# EAGLE design Hank (EAGLE 9.5.2)
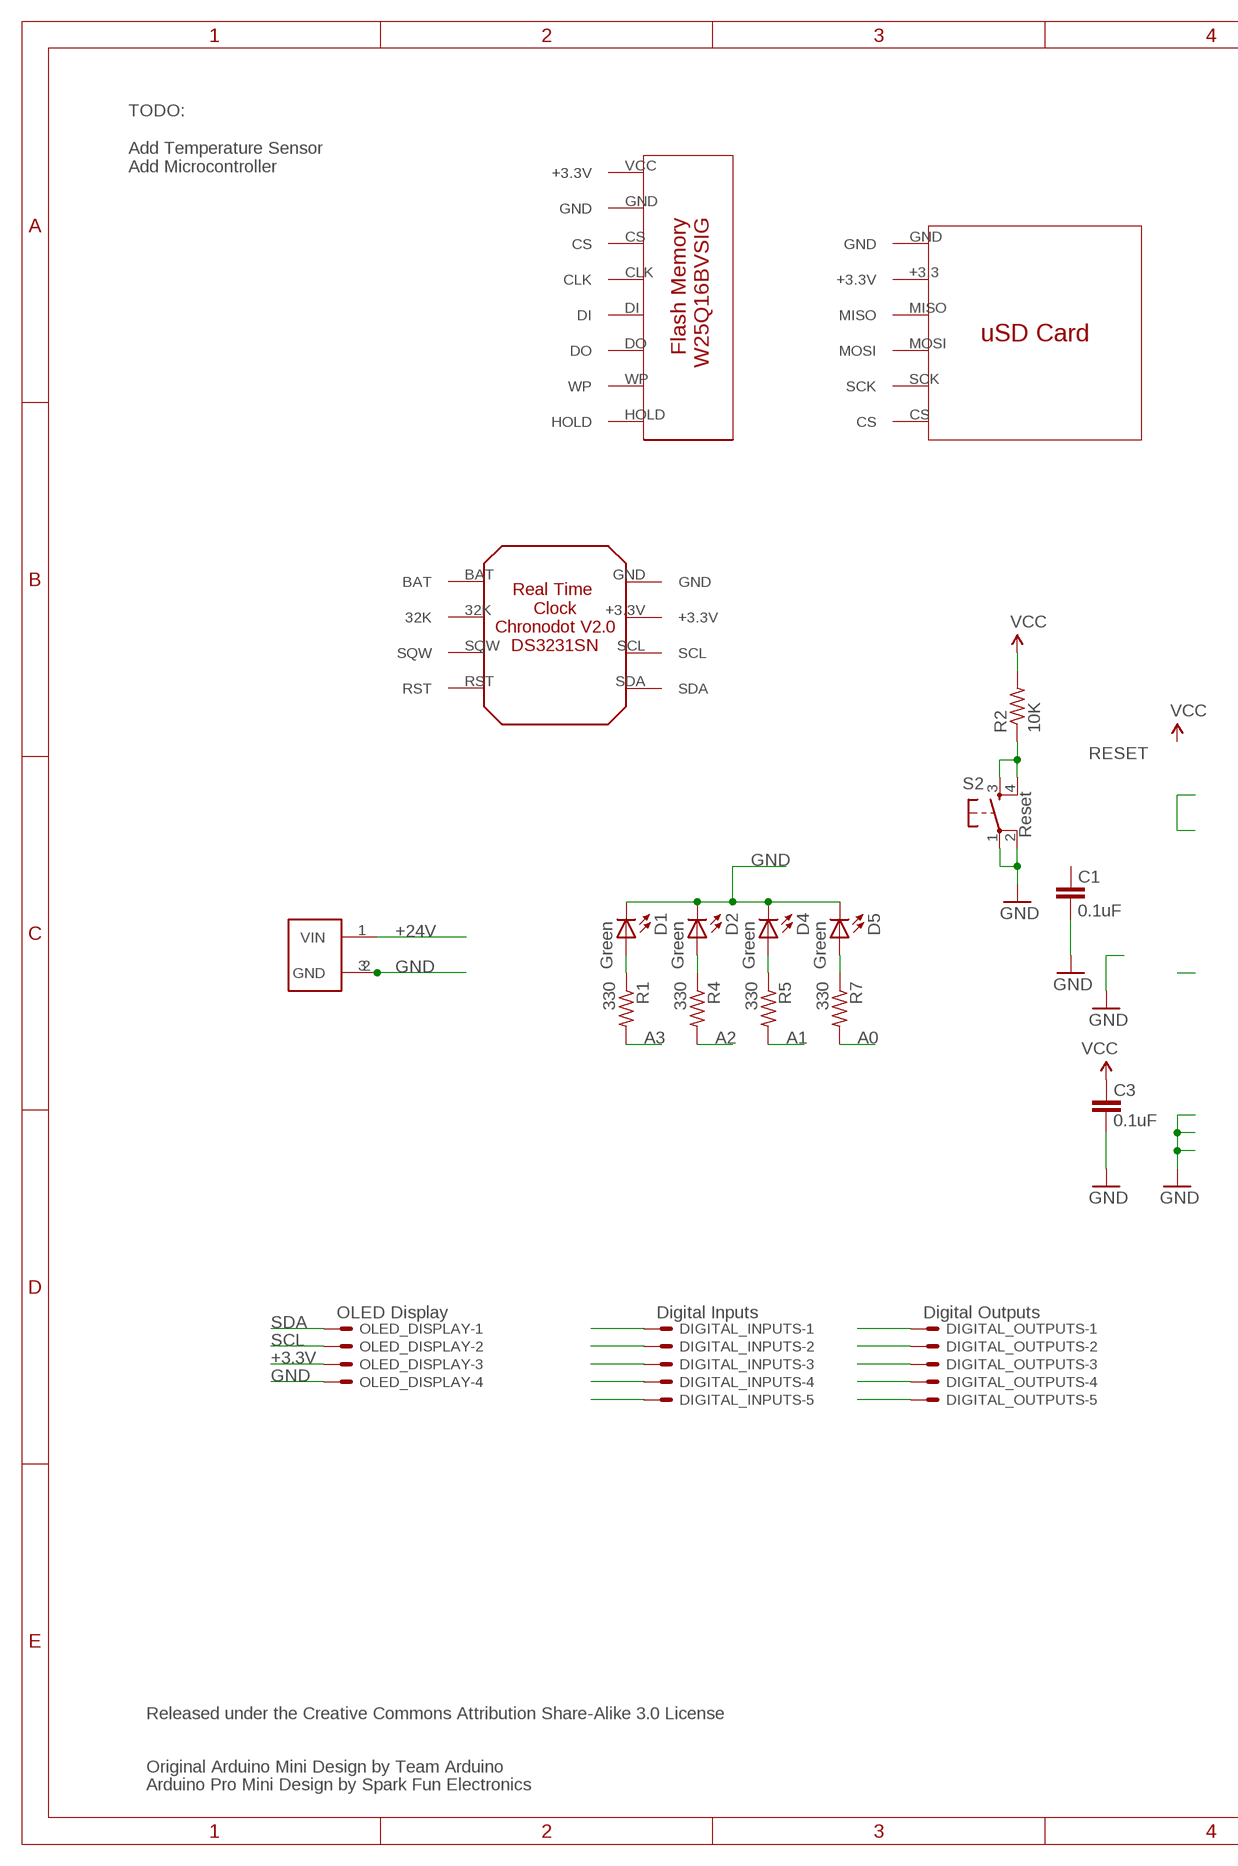
[diagram p0: schematic, sheet 1, part 1 of 2]
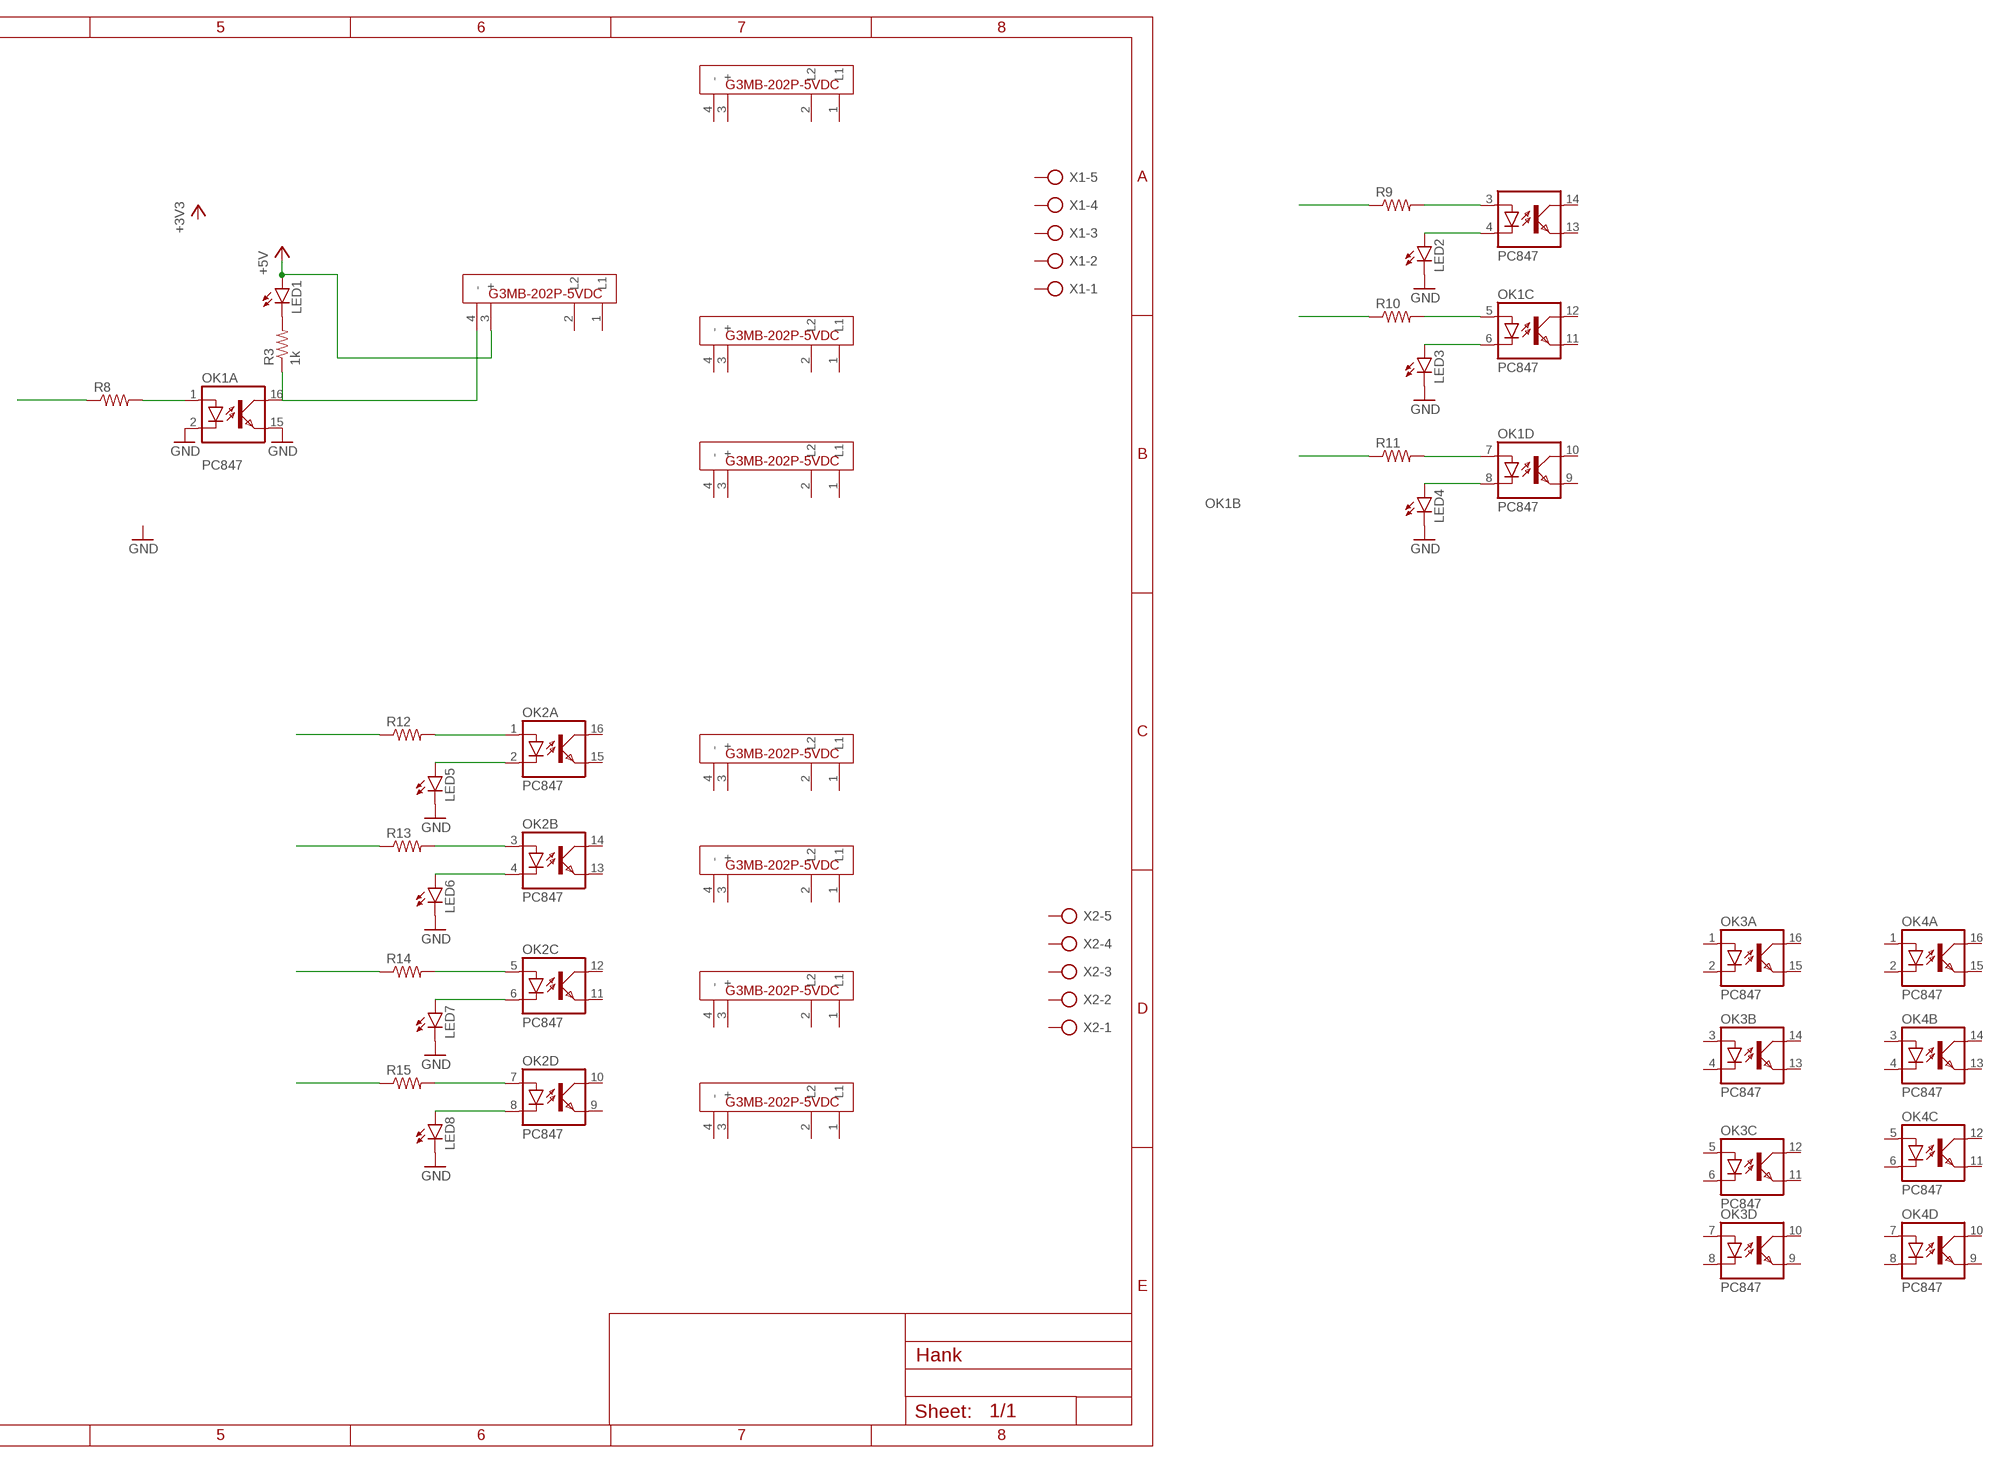
[diagram p1: schematic, sheet 1, part 2 of 2]

## Parts
C1  0.1uF  C-EUC0603  [C0603]
C3  0.1uF  C-EUC0603  [C0603]
D1  Green  LED0603  [LED-0603]
D2  Green  LED0603  [LED-0603]
D4  Green  LED0603  [LED-0603]
D5  Green  LED0603  [LED-0603]
DIGITAL_INPUTS  Digital Inputs  22-23-2051  [22-23-2051]
DIGITAL_OUTPUTS  Digital Outputs  22-23-2051  [22-23-2051]
LED1  LED3MM  [LED3MM]
LED2  LED3MM  [LED3MM]
LED3  LED3MM  [LED3MM]
LED4  LED3MM  [LED3MM]
LED5  LED3MM  [LED3MM]
LED6  LED3MM  [LED3MM]
LED7  LED3MM  [LED3MM]
LED8  LED3MM  [LED3MM]
OK1  PC847  [DIL16]
OK2  PC847  [DIL16]
OK3  PC847  [DIL16]
OK4  PC847  [DIL16]
OLED_DISPLAY  OLED Display  22-23-2041  [22-23-2041]
R1  330  R-US_R0603  [R0603]
R2  10K  R-US_R0603  [R0603]
R3  1k  R-US_0207/10  [0207/10]
R4  330  R-US_R0603  [R0603]
R5  330  R-US_R0603  [R0603]
R7  330  R-US_R0603  [R0603]
R8  R-US_0207/10  [0207/10]
R9  R-US_0207/10  [0207/10]
R10  R-US_0207/10  [0207/10]
R11  R-US_0207/10  [0207/10]
R12  R-US_0207/10  [0207/10]
R13  R-US_0207/10  [0207/10]
R14  R-US_0207/10  [0207/10]
R15  R-US_0207/10  [0207/10]
S2  Reset  TAC_SWITCHSMD  [TACTILE_SWITCH_SMD]
U$1  SSR  [SSR_FOOTPRINT]
U$3  BARREL-3.5MM  [BARREL-3.5MM]
U$4  FLASH_MEMORY  [FLASHMEMORY_FOOTPRINT]
U$6  RTC  [RTC_FOOTPRINT]
U$7  SSR  [SSR_FOOTPRINT]
U$8  SSR  [SSR_FOOTPRINT]
U$9  SSR  [SSR_FOOTPRINT]
U$10  SSR  [SSR_FOOTPRINT]
U$11  SSR  [SSR_FOOTPRINT]
U$12  SSR  [SSR_FOOTPRINT]
U$13  SSR  [SSR_FOOTPRINT]
U$14  SD_CARD_READER  [SD_CARD_READER_FOOTPRINT]
X1  AK300/5  [AK300/5]
X2  AK300/5  [AK300/5]

## Nets
+3.3V: OLED_DISPLAY.3
+5V: LED1.A U$7.3(+)
+24V: U$3.1(VIN)
A0: R7.2
A1: R5.2
A2: R4.2
A3: R1.2
GND [vcc]: C1.1 C3.1 D1.C D2.C D4.C D5.C LED2.K(C) LED3.K(C) LED4.K(C) LED5.K(C) LED6.K(C) LED7.K(C) LED8.K(C) OK1.2(A:C) OK1.15(A:EMIT) OLED_DISPLAY.4 S2.1 S2.2 U$3.2(GND__) U$3.3(GND)
N$2: DIGITAL_INPUTS.1
N$3: D1.A R1.1
N$4: D2.A R4.1
N$5: D4.A R5.1
N$6: DIGITAL_INPUTS.2
N$7: DIGITAL_INPUTS.3
N$8: D5.A R7.1
N$9: DIGITAL_INPUTS.4
N$10: DIGITAL_INPUTS.5
N$11: DIGITAL_OUTPUTS.1
N$12: DIGITAL_OUTPUTS.2
N$13: DIGITAL_OUTPUTS.3
N$14: DIGITAL_OUTPUTS.4
N$15: DIGITAL_OUTPUTS.5
N$16: LED4.A OK1.8(D:C)
N$17: OK1.7(D:A) R11.2
N$18: OK1.1(A:A) R8.2
N$19: LED1.K(C) R3.2
N$20: OK1.3(B:A) R9.2
N$21: LED2.A OK1.4(B:C)
N$22: OK1.5(C:A) R10.2
N$23: LED3.A OK1.6(C:C)
N$24: OK2.1(A:A) R12.2
N$25: OK2.3(B:A) R13.2
N$26: OK2.5(C:A) R14.2
N$27: OK2.7(D:A) R15.2
N$28: LED6.A OK2.4(B:C)
N$29: LED5.A OK2.2(A:C)
N$30: LED7.A OK2.6(C:C)
N$31: LED8.A OK2.8(D:C)
N$32: R8.1
N$33: R9.1
N$34: R10.1
N$35: R11.1
N$36: R12.1
N$37: R13.1
N$38: R14.1
N$39: R15.1
N$42: OK1.16(A:COL) R3.1 U$7.4(-)
RESET: R2.1 S2.3 S2.4
SCL: OLED_DISPLAY.2
SDA: OLED_DISPLAY.1
VCC: C3.2 R2.2
Unconnected: C1.2 OK1.9(D:EMIT) OK1.10(D:COL) OK1.11(C:EMIT) OK1.12(C:COL) OK1.13(B:EMIT) OK1.14(B:COL) OK2.9(D:EMIT) OK2.10(D:COL) OK2.11(C:EMIT) OK2.12(C:COL) OK2.13(B:EMIT) OK2.14(B:COL) OK2.15(A:EMIT) OK2.16(A:COL) OK3.1(A:A) OK3.2(A:C) OK3.3(B:A) OK3.4(B:C) OK3.5(C:A) OK3.6(C:C) OK3.7(D:A) OK3.8(D:C) OK3.9(D:EMIT) OK3.10(D:COL) OK3.11(C:EMIT) OK3.12(C:COL) OK3.13(B:EMIT) OK3.14(B:COL) OK3.15(A:EMIT) OK3.16(A:COL) OK4.1(A:A) OK4.2(A:C) OK4.3(B:A) OK4.4(B:C) OK4.5(C:A) OK4.6(C:C) OK4.7(D:A) OK4.8(D:C) OK4.9(D:EMIT) OK4.10(D:COL) OK4.11(C:EMIT) OK4.12(C:COL) OK4.13(B:EMIT) OK4.14(B:COL) OK4.15(A:EMIT) OK4.16(A:COL) U$1.1(L1) U$1.2(L2) U$1.3(+) U$1.4(-) U$4.CLK U$4.CS U$4.DI U$4.DO U$4.GND U$4.HOLD U$4.VCC(+3.3V) U$4.WP U$6.32K U$6.+3.3V U$6.BAT U$6.GND U$6.RST U$6.SCL U$6.SDA U$6.SQW U$7.1(L1) U$7.2(L2) U$8.1(L1) U$8.2(L2) U$8.3(+) U$8.4(-) U$9.1(L1) U$9.2(L2) U$9.3(+) U$9.4(-) U$10.1(L1) U$10.2(L2) U$10.3(+) U$10.4(-) U$11.1(L1) U$11.2(L2) U$11.3(+) U$11.4(-) U$12.1(L1) U$12.2(L2) U$12.3(+) U$12.4(-) U$13.1(L1) U$13.2(L2) U$13.3(+) U$13.4(-) U$14.+3.3(+3.3V) U$14.CS U$14.GND U$14.MISO U$14.MOSI U$14.SCK X1.1 X1.2 X1.3 X1.4 X1.5 X2.1 X2.2 X2.3 X2.4 X2.5

## Notes on the sheet
- TODO:
  
  Add Temperature Sensor
  Add Microcontroller
- Released under the Creative Commons Attribution Share-Alike 3.0 License
- Original Arduino Mini Design by Team Arduino
- Arduino Pro Mini Design by Spark Fun Electronics

## Library data of the parts
C1 C3 = resistor:C-EU: CAPACITOR, European symbol
D1 D2 D4 D5 = SparkFun:LED: LEDs Standard schematic elements and footprints for 5mm, 3mm, 1206, and 0603 sized LEDs. 5mm - Spark Fun Electronics SKU : COM-00529 (and others)
DIGITAL_INPUTS DIGITAL_OUTPUTS = con-molex:22-23-2051: .100" (2.54mm) Center Header - 5 Pin; MF: MOLEX; MPN: 22-23-2051; OC_FARNELL: 1462952; OC_NEWARK: 38C9178
LED1-LED8 = led:LED: LED OSRAM: - CHIPLED LG R971, LG N971, LY N971, LG Q971, LY Q971, LO R971, LY R971 LH N974, LH R974 LS Q976, LO Q976, LY Q976 LO Q996 - Hyper CHIPLED LW Q18S LB Q993, LB Q99A, LB R99A - SideLED LS A670, LO A670, LY A670, LG A670, LP A670 LB A673, LV A673, LT A673, LW A673 LH A674 LY A675 LS A676, LA A676, LO A676, LY A676, LW A676 LS A679, LY A679, LG A679 - Hyper Micro SIDELED® LS Y876, LA Y876, LO Y876, LY Y876 LT Y87S - SmartLED LW L88C, LW L88S LB L89C, LB L89S, LG L890 LS L89K, LO L89K, LY L89K LS L896, LA L896, LO L896, LY L896 - TOPLED LS T670, LO T670, LY T670, LG T670, LP T670 LSG T670, LSP T670, LSY T670, LOP T670, LYG T670 LG T671, LOG T671, LSG T671 LB T673, LV T673, LT T673, LW T673 LH T674 LS T676, LA T676, LO T676, LY T676, LB T676, LH T676, LSB T676, LW T676 LB T67C, LV T67C, LT T67C, LS T67K, LO T67K, LY T67K, LW E67C LS E67B, LA E67B, LO E67B, LY E67B, LB E67C, LV E67C, LT E67C LW T67C LS T679, LY T679, LG T679 LS T770, LO T770, LY T770, LG T770, LP T770 LB T773, LV T773, LT T773, LW T773 LH T774 LS E675, LA E675, LY E675, LS T675 LS T776, LA T776, LO T776, LY T776, LB T776 LHGB T686 LT T68C, LB T68C - Hyper Mini TOPLED® LB M676 - Mini TOPLED Santana® LG M470 LS M47K, LO M47K, LY M47K Source: http://www.osram.convergy.de LUXEON: - LUMILED® LXK2-PW12-R00, LXK2-PW12-S00, LXK2-PW14-U00, LXK2-PW14-V00 LXK2-PM12-R00, LXK2-PM12-S00, LXK2-PM14-U00 LXK2-PE12-Q00, LXK2-PE12-R00, LXK2-PE12-S00, LXK2-PE14-T00, LXK2-PE14-U00 LXK2-PB12-K00, LXK2-PB12-L00, LXK2-PB12-M00, LXK2-PB14-N00, LXK2-PB14-P00, LXK2-PB14-Q00 LXK2-PR12-L00, LXK2-PR12-M00, LXK2-PR14-Q00, LXK2-PR14-R00 LXK2-PD12-Q00, LXK2-PD12-R00, LXK2-PD12-S00 LXK2-PH12-R00, LXK2-PH12-S00 LXK2-PL12-P00, LXK2-PL12-Q00, LXK2-PL12-R00 Source: www.luxeon.com KINGBRIGHT: KA-3528ASYC Source: www.kingbright.com
OK1-OK4 = optocoupler:PC847: SHARP OPTO COUPLER; OC_FARNELL: 9707735; OC_NEWARK: unknown
OLED_DISPLAY = con-molex:22-23-2041: .100" (2.54mm) Center Header - 4 Pin; MF: MOLEX; MPN: 22-23-2041; OC_FARNELL: 1462920; OC_NEWARK: 38C0355
R1 R2 R4 R5 R7 = resistor:R-US_: RESISTOR, American symbol
R3 R8-R15 = rcl:R-US_: RESISTOR, American symbol; SPICEPREFIX: R
S2 = SparkFun:TAC_SWITCH: Momentary Switch Button commonly used for reset or general input. Spark Fun Electronics SKU : COM-00097
U$1 U$7-U$13 = HankLibraries:SSR
U$3 = #ROBO-Tutorial:BARREL-3.5MM
U$4 = HankLibraries:FLASH_MEMORY
U$6 = HankLibraries:RTC: Real Time Clock PCB Using DS3231SN. Developed by JVivas
U$14 = HankLibraries:SD_CARD_READER
X1 X2 = con-ptr500:AK300/5: CONNECTOR; OC_FARNELL: unknown; OC_NEWARK: unknown

## Net classes
1 vcc: width 0.254 mm

## Board
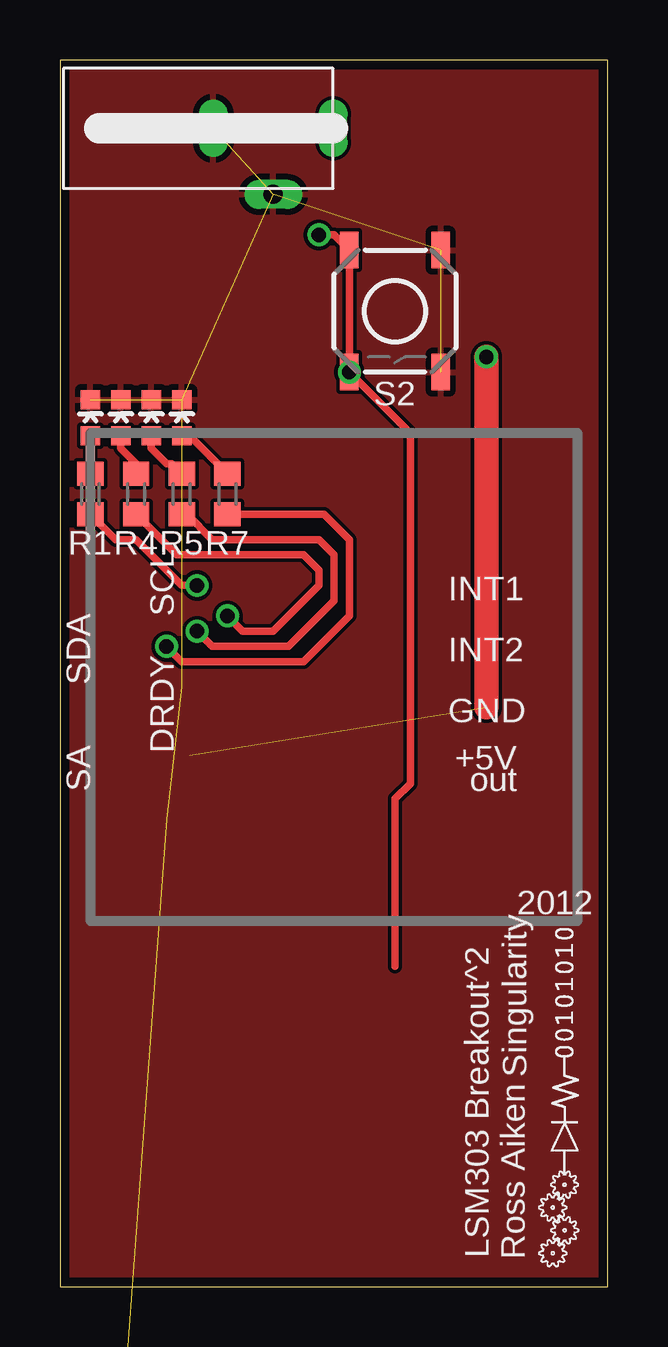
[diagram p2: board, top side]
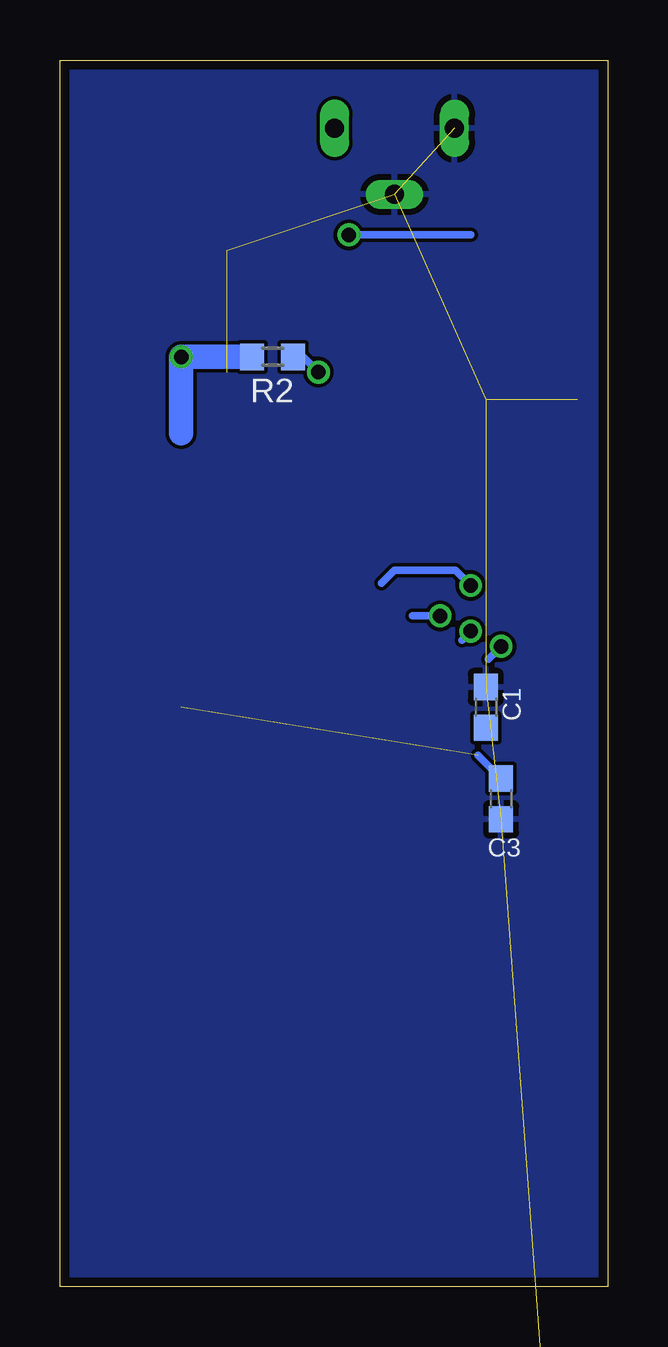
[diagram p3: board, bottom side, seen from below]

Size 22.84 x 51.1 mm. Coordinates in mm from the lower left corner, seen from the top.
Outline: 0,0 22.84,0 22.84,51.1 0,51.1 0,0
Copper layers (1*16): Top 0.0356mm / dielectric 1.5011mm / Bottom 0.0356mm
Design rules "default": minimum track width 6mil, minimum drill 13mil, track to track 6mil, track to pad 6mil, pad to pad 6mil, via to via 6mil, smd to smd 0mil, copper to edge 15mil, drill to drill 6mil, minimum pad ring 7mil, minimum via ring 7mil, stop-mask expansion 4mil, vias tented up to drill 0mil, thermal gap 10mil

### Footprints (pad centres in the part's own frame; a part is rotated, then mirrored left to right if it is on the bottom)
C0603 = smd 1.1 x 1: 1 -0.85,0; 2 0.85,0
LED-0603 = smd 0.8 x 0.8: A 0,-0.75; C 0,0.75
22-23-2051 = drill 1 long: 1 -5.08,0; 2 -2.54,0; 3 0,0; 4 2.54,0; 5 5.08,0
LED3MM = drill 0.813 octagon: A -1.27,0; K 1.27,0
DIL16 = drill 0.813 offset: 1 -8.89,-3.81; 2 -6.35,-3.81; 3 -3.81,-3.81; 4 -1.27,-3.81; 5 1.27,-3.81; 6 3.81,-3.81; 7 6.35,-3.81; 8 8.89,-3.81; 9 8.89,3.81; 10 6.35,3.81; 11 3.81,3.81; 12 1.27,3.81; 13 -1.27,3.81; 14 -3.81,3.81; 15 -6.35,3.81; 16 -8.89,3.81
22-23-2041 = drill 1 long: 1 -3.81,0; 2 -1.27,0; 3 1.27,0; 4 3.81,0
R0603 = smd 1 x 1.1: 1 -0.85,0; 2 0.85,0
0207/10 = drill 0.813 octagon: 1 -5.08,0; 2 5.08,0
TACTILE_SWITCH_SMD = smd 1.524 x 0.762: 1 -2.54,1.905; 2 2.54,1.905; 3 -2.54,-1.905; 4 2.54,-1.905
SSR_FOOTPRINT = drill 0.6 long: 1 5.08,0; 2 1.27,0; 3 -3.81,0; 4 -5.08,0
BARREL-3.5MM = drill 0.8 long: 1 2.5,0; 2 -2.5,0; 3 0,-2.75
FLASHMEMORY_FOOTPRINT = drill 0.6 long: CLK -8.89,1.27; CS -8.89,3.81; DI -8.89,-1.27; DO -8.89,-3.81; GND -8.89,6.35; HOLD -8.89,-8.89; VCC -8.89,8.89; WP -8.89,-6.35
RTC_FOOTPRINT = drill 0.6 long: 32K -6.35,2.54; +3.3V 6.35,2.54; BAT -6.35,5.08; GND 6.35,5.08; RST -6.35,-2.54; SCL 6.35,0; SDA 6.35,-2.54; SQW -6.35,0
SD_CARD_READER_FOOTPRINT = drill 0.6 long: +3.3 0,-1.27; CS 0,-6.35; GND 0,0; MISO 0,-2.54; MOSI 0,-3.81; SCK 0,-5.08
AK300/5 = drill 1.321 long: 1 -10.008,0; 2 -5.004,0; 3 0,0; 4 5.004,0; 5 10.008,0

### Placement (x,y rotation side)
C1  5.08,24.13 270 bottom
C3  4.45,20.32 90 bottom
D1  1.27,36.2 0 top
D2  2.54,36.2 0 top
D4  3.81,36.2 0 top
D5  5.08,36.2 0 top
DIGITAL_INPUTS  -8.44,-358.77 0 top  (outside the outline)
DIGITAL_OUTPUTS  -8.44,-369.64 0 top  (outside the outline)
LED1  -13.14,-289.53 0 top  (outside the outline)
LED2  -13.14,-293.91 0 top  (outside the outline)
LED3  -13.14,-298.28 0 top  (outside the outline)
LED4  -13.14,-302.65 0 top  (outside the outline)
LED5  -13.14,-307.02 0 top  (outside the outline)
LED6  -13.14,-311.4 0 top  (outside the outline)
LED7  -13.14,-315.77 0 top  (outside the outline)
LED8  -13.14,-320.14 0 top  (outside the outline)
OK1  -0.41,-134.99 0 top  (outside the outline)
OK2  -0.41,-146.89 0 top  (outside the outline)
OK3  -0.41,-158.78 0 top  (outside the outline)
OK4  -0.41,-170.67 0 top  (outside the outline)
OLED_DISPLAY  -1.72,-12.37 0 top  (outside the outline)
R1  1.27,33.02 270 top
R2  13.97,38.73 180 bottom
R3  -9.51,-378.59 0 top  (outside the outline)
R4  3.17,33.02 270 top
R5  5.08,33.02 270 top
R7  6.99,33.02 270 top
R8  -9.51,-254.07 0 top  (outside the outline)
R9  -9.51,-258.64 0 top  (outside the outline)
R10  -9.51,-263.22 0 top  (outside the outline)
R11  -9.51,-267.8 0 top  (outside the outline)
R12  -9.51,-272.37 0 top  (outside the outline)
R13  -9.51,-276.95 0 top  (outside the outline)
R14  -9.51,-281.52 0 top  (outside the outline)
R15  -9.51,-286.1 0 top  (outside the outline)
S2  13.97,40.64 270 top
U$1  -7.6,-198.75 0 top  (outside the outline)
U$3  8.89,48.26 0 top
U$4  8.89,-79.3 0 top  (outside the outline)
U$6  -6.35,-189.72 0 top  (outside the outline)
U$7  -5.08,-125.16 0 top  (outside the outline)
U$8  -7.6,-205.26 0 top  (outside the outline)
U$9  -7.6,-211.76 0 top  (outside the outline)
U$10  -7.6,-218.26 0 top  (outside the outline)
U$11  -7.6,-224.77 0 top  (outside the outline)
U$12  -7.6,-231.27 0 top  (outside the outline)
U$13  -7.6,-237.78 0 top  (outside the outline)
U$14  -12.69,-243.01 0 top  (outside the outline)
X1  -2.13,-331.6 0 top  (outside the outline)
X2  -2.13,-347.19 0 top  (outside the outline)

### Tracks (layer width: path | path; a pad name or v marks a point on that pad's centre or on a via)
+5V  (1 unrouted)
A0  (via drill 0.6)
  Top 0.305: R7.2 11.01,32.17 12.06,31.11 12.06,27.94 10.16,26.04 5.08,26.04 v4.45,26.67
  Bottom 0.305: v4.45,26.67 4.99,26.13
A1  (via drill 0.6)
  Top 0.305: R5.2 5.29,32.17 6.35,31.11 10.79,31.11 11.43,30.48 11.43,28.57 9.53,26.67 6.35,26.67 v5.71,27.3
  Bottom 0.305: 6.09,26.93 v5.71,27.3
A2  (via drill 0.6)
  Top 0.305: R4.2 4.87,30.48 10.16,30.48 10.79,29.84 10.79,29.21 8.89,27.3 7.62,27.3 v6.99,27.94
  Bottom 0.305: v6.99,27.94 8.15,27.94
A3  (via drill 0.6)
  Top 0.305: R1.2 2.33,31.11 3.17,31.11 5.08,29.21 v5.71,29.21
  Bottom 0.305: v5.71,29.21 6.35,29.84 8.89,29.84 9.43,29.3
GND  (19 unrouted)
  pour Bottom (isolate 0.152): 0,51.44 22.86,51.44 22.86,0 0,0
  pour Top (isolate 0.152): 0,51.44 22.86,51.44 22.86,0 0,0
N$3
  Top 0.305: D1.A R1.1
N$4
  Top 0.305: D2.A 2.54,34.92 3.17,34.29 R4.1
N$5
  Top 0.305: D4.A 3.81,34.92 4.45,34.29 4.66,34.29 R5.1
N$8
  Top 0.305: D5.A 5.41,35.45 R7.1
N$16  (1 unrouted)
N$17  (1 unrouted)
N$18  (1 unrouted)
N$19  (1 unrouted)
N$20  (1 unrouted)
N$21  (1 unrouted)
N$22  (1 unrouted)
N$23  (1 unrouted)
N$24  (1 unrouted)
N$25  (1 unrouted)
N$26  (1 unrouted)
N$27  (1 unrouted)
N$28  (1 unrouted)
N$29  (1 unrouted)
N$30  (1 unrouted)
N$31  (1 unrouted)
N$42  (2 unrouted)
RESET  (via drill 0.6)
  Top 0.305: v10.79,43.81 11.43,43.81 S2.3 v12.06,38.1 14.61,35.56 14.61,20.95 13.97,20.32 13.97,13.34
  Bottom 0.305: R2.1 12.7,38.73 v12.06,38.1 11.83,37.87 | v10.79,43.81 5.71,43.81
VCC  (via drill 0.6)  (1 unrouted)
  Top 1.016: 17.78,24.13 v17.78,38.73
  Bottom 0.305: C3.2 5.41,22.13
  Bottom 1.016: R2.2 v17.78,38.73 17.78,35.56

### Text on the board
tNames: INT1 | SCL | INT2 | SDA | GND | +5V | DRDY | out | SA | 2012 | Singularity | LSM303 Breakout^2 | Ross Aiken | E:/Users/Ross/Desktop/Logo_nocolor.bmp | E:/Users/Ross/Desktop/Logo_nocolor.bmp